# Altium project GEM_HV_channel.PrjPcb (part 2 of 2)
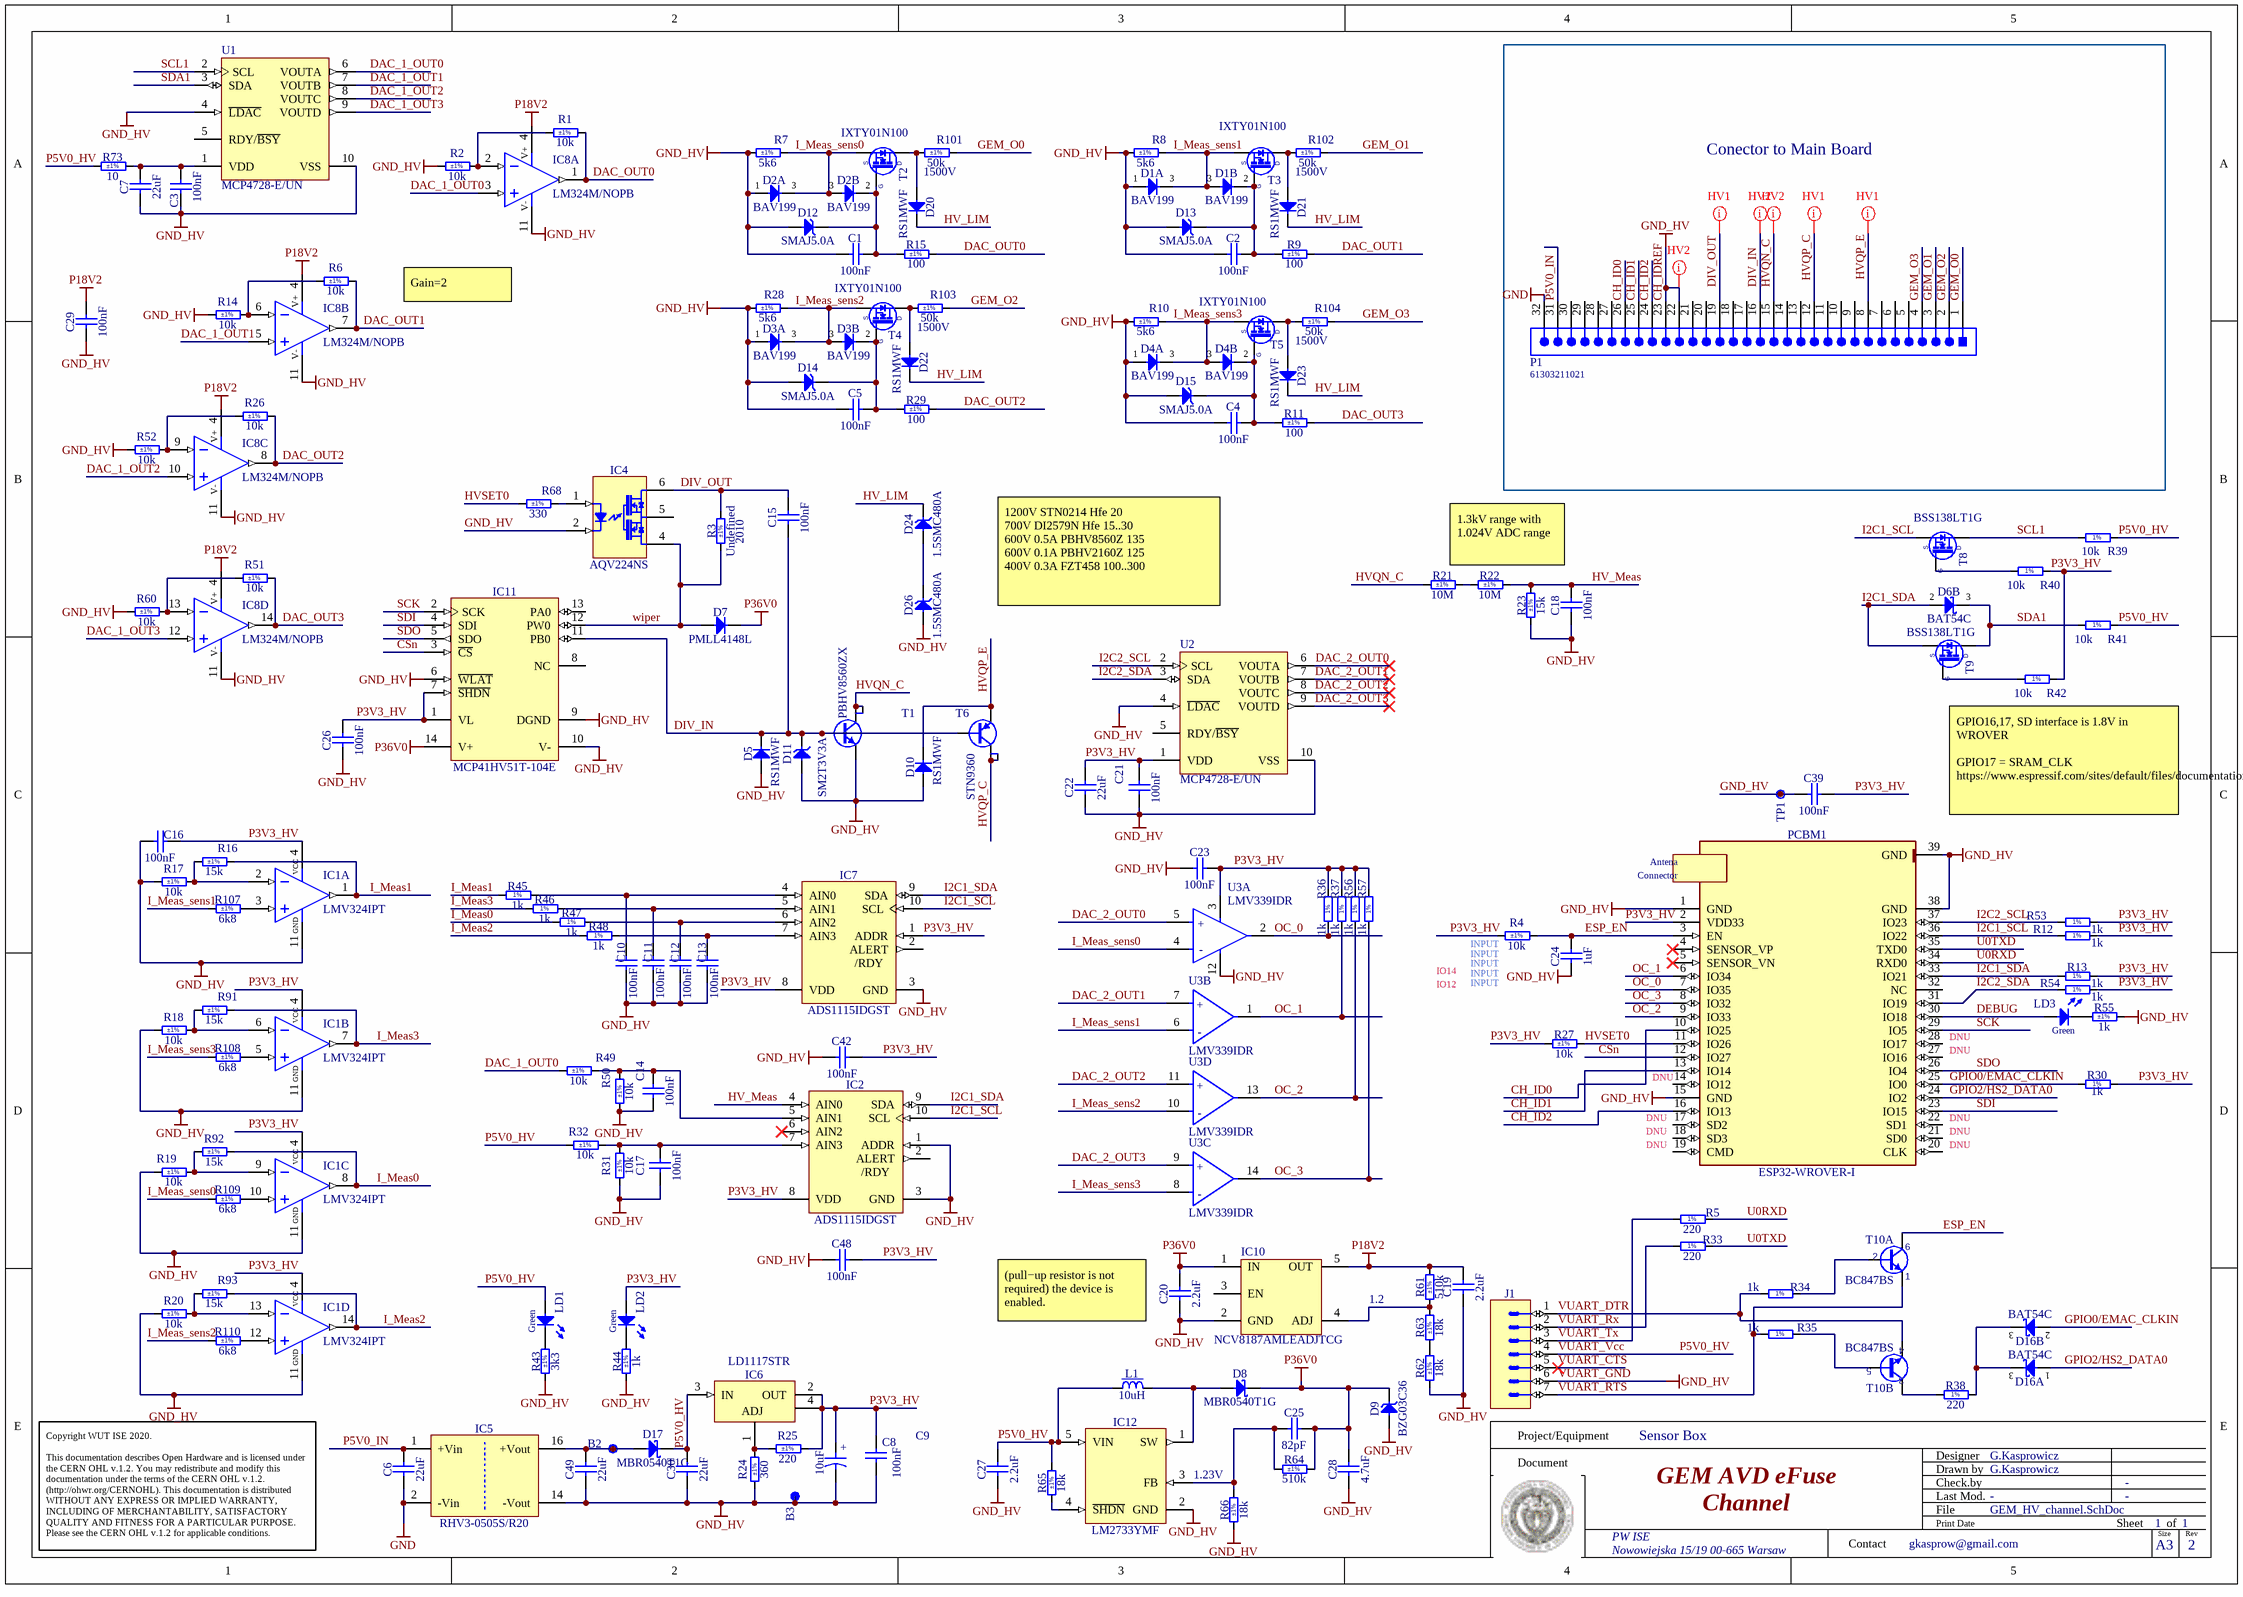
[diagram p1: GEM_HV_channel.SchDoc]

## Sheet GEM_HV_channel.SchDoc: GEM AVD eFuse (continued)

### Library data of the parts
B2 B3 = SMD_PAD_D1MM: Pad; Part Description: 1mm Diameter SMD Pad; Mounted: No; Part Number: SMD_PAD_D1MM; Component Kind: Standard (No BOM); Component Type: Standard (No BOM); Pin Count: 1; Family: SMD Pad; Socket: No; SMD: Yes; Sense: No; Status: None; ComponentHeight: 0mm; HelpURL: Undefined; Author: CERN DEM JLC; CreateDate: 10.10.2017; LatestRevisionDate: 10.10.2017; PackageDescription: 1mm Diameter SMD Pad
C1-C5 C9-C14 C16-C18 C21 C23 C26 C29 C39 C42 C48 = CC0603_100NF_50V_10%_X5R: Non-polarised capacitor; Part Description: SMD Multilayer Chip Ceramic Capacitor; Manufacturer: GENERIC; Manufacturer1 Part Number: C1608X5R1H104K080; Voltage: 50V; TC: X5R; Tolerance: ±10%; Part Number: CC0603_100NF_50V_10%_X5R; Component Kind: Standard; Component Type: Standard; Pin Count: 2; Value: 100nF; Status: None; Manufacturer Part Number: CC0603_100NF_50V_10%_X5R; Case: 0603; Mounted: Yes; Socket: No; SMD: Yes; Sense: No; Manufacturer1 Example: TDK; Manufacturer1 ComponentHeight: 0.9mm; HelpURL: \\cern.ch\dfs\Applications\Altium\Datasheets\CC0603_X5R_TDK_C.pdf; Author: CERN DEM MR; CreateDate: 08.01.2016; LatestRevisionDate: 08.01.2016
C6 C7 C22 C30 C49 = CC0805_22UF_25V_20%_X5R: Non-polarised capacitor; Part Description: Chip Multilayer Ceramic Capacitor for General Purpose; Manufacturer: GENERIC; Manufacturer1 Part Number: GRM21BR61E226ME44; Voltage: 25V; TC: X5R; Tolerance: ±20%; Part Number: CC0805_22UF_25V_20%_X5R; Component Kind: Standard; Component Type: Standard; Pin Count: 2; Value: 22uF; Status: Preferred; Manufacturer Part Number: CC0805_22UF_25V_20%_X5R; Case: 0805; Mounted: Yes; Socket: No; SMD: Yes; Sense: No; ComponentHeight: 1.45mm; Manufacturer1 Example: MURATA; Manufacturer1 ComponentHeight: 1.45mm; HelpURL: \\cern.ch\dfs\Applications\Altium\Datasheets\CC0805_MURATA_GRM21BR61E226ME44.pdf; Author: CERN DEM WB; CreateDate: 08.10.2021; LatestRevisionDate: 08.10.2021
C8 = CAE430-540_10UF_16V_20%: Polarised capacitor; Part Description: Aluminum Electrolytic SMT Capacitor; Manufacturer: PANASONIC; Manufacturer Part Number: EEEFK1C100AR; Voltage: 16V; Tolerance: ±20%; Part Number: CAE430-540_10UF_16V_20%; Component Kind: Standard; Component Type: Standard; Pin Count: 2; Value: 10uF; Status: Not Recommended; Case: B; Mounted: Yes; Socket: No; SMD: Yes; Sense: No; ComponentHeight: 5.8mm; HelpURL: \\cern.ch\dfs\Applications\Altium\Datasheets\CAE_PANASONIC_FK-V.pdf; Author: CERN DEM JLC; CreateDate: 03.12.2007; LatestRevisionDate: 05.11.2014
C15 = CC1812_100NF_1000V_10%_X7R_KEMET_HV FT-CAP: Non-polarised capacitor; Part Description: High Voltage Flexible Termination System (HV FT-CAP) SMD Multilayer Ceramic  Chip Capacitor; Manufacturer: KEMET; Manufacturer Part Number: C1812X104KDRACTU; Voltage: 1000V; TC: X7R; Tolerance: ±10%; Part Number: CC1812_100NF_1000V_10%_X7R_KEMET_HV FT-CAP; Component Kind: Standard; Component Type: Standard; Pin Count: 2; Value: 100nF; Status: None; Case: 1812; Mounted: Yes; Socket: No; SMD: Yes; Sense: No; ComponentHeight: 1.85mm; HelpURL: \\cern.ch\dfs\Applications\Altium\Datasheets\CC1812_X7R_KEMET_HV FT-CAP.pdf; Author: CERN DEM MR; CreateDate: 20.04.2017; LatestRevisionDate: 20.04.2017
C19 C20 C27 = CC0603_2.2UF_16V_10%_X5R: Non-polarised capacitor; Part Description: SMD Multilayer Chip Ceramic Capacitor; Manufacturer: GENERIC; Manufacturer1 Part Number: CC0603KRX5R7BB225; Voltage: 16V; TC: X5R; Tolerance: ±10%; Part Number: CC0603_2.2UF_16V_10%_X5R; Component Kind: Standard; Component Type: Standard; Pin Count: 2; Value: 2.2uF; Status: Preferred; Manufacturer Part Number: CC0603_2.2UF_16V_10%_X5R; Case: 0603; Mounted: Yes; Socket: No; SMD: Yes; Sense: No; Manufacturer1 Example: YAGEO PHYCOMP; Manufacturer1 ComponentHeight: 0.9mm; HelpURL: \\cern.ch\dfs\Applications\Altium\Datasheets\CC0805_X5R_PHYCOMP_HC.pdf; Author: CERN DEM JLC; CreateDate: 28.04.2011; LatestRevisionDate: 28.04.2011
C24 = CC0603_1UF_25V_10%_X7R: Non-polarised capacitor; Part Description: SMD Multilayer Chip Ceramic Capacitor; Manufacturer: GENERIC; Manufacturer1 Part Number: GRM188R71E105KA12D; Voltage: 25V; TC: X7R; Tolerance: ±10%; Part Number: CC0603_1UF_25V_10%_X7R; Component Kind: Standard; Component Type: Standard; Pin Count: 2; Value: 1uF; Status: None; Manufacturer Part Number: CC0603_1UF_25V_10%_X7R; Case: 0603; Mounted: Yes; Socket: No; SMD: Yes; Sense: No; Manufacturer1 Example: MURATA; Manufacturer1 ComponentHeight: 0.9mm; HelpURL: \\cern.ch\dfs\Applications\Altium\Datasheets\CC0603_X7R_MURATA.pdf; Author: CERN DEM JLC; CreateDate: 18/01/2011; LatestRevisionDate: 18/01/2011
C25 = CC0603_82PF_50V_5%_NP0: Non-polarised capacitor; Part Description: SMD Multilayer Chip Ceramic Capacitor; Manufacturer: GENERIC; Manufacturer1 Part Number: 223886715829; Voltage: 50V; TC: C0G/NP0; Tolerance: ±5%; Part Number: CC0603_82PF_50V_5%_NP0; Component Kind: Standard; Component Type: Standard; Pin Count: 2; Value: 82pF; Status: Preferred; Manufacturer Part Number: CC0603_82PF_50V_5%_NP0; Case: 0603; Mounted: Yes; Socket: No; SMD: Yes; Sense: No; Manufacturer1 Example: PHYCOMP; Manufacturer1 ComponentHeight: 0.87mm; HelpURL: \\cern.ch\dfs\Applications\Altium\Datasheets\CC0603_NP0_PHYCOMP.pdf; Author: CERN DEM JLC; CreateDate: 03.12.2007; LatestRevisionDate: 03.12.2007
C28 = CC1210_4.7UF_50V_10%_X7R: Non-polarised capacitor; Part Description: SMD Multilayer Chip Ceramic Capacitor; Manufacturer: GENERIC; Manufacturer1 Part Number: C1210C475K5RAC; Voltage: 50V; TC: X7R; Tolerance: ±10%; Part Number: CC1210_4.7UF_50V_10%_X7R; Component Kind: Standard; Component Type: Standard; Pin Count: 2; Value: 4.7uF; Status: None; Manufacturer Part Number: CC1210_4.7UF_50V_10%_X7R; Case: 1210; Mounted: Yes; Socket: No; SMD: Yes; Sense: No; Manufacturer1 Example: KEMET; Manufacturer1 ComponentHeight: 2.7mm; HelpURL: \\cern.ch\dfs\Applications\Altium\Datasheets\CC1210_X7R_KEMET.pdf; Author: CERN DEM JLC; CreateDate: 01.04.2009; LatestRevisionDate: 05.05.2009
D1-D4 = BAV199: Serial Diode; Part Description: Low-Leakage Double Diode; Manufacturer: NXP SEMICONDUCTORS; Voltage: 75V; Power: 250mW; PressFit: No; Bonding: No; Part Number: BAV199; Component Kind: Standard; Component Type: Standard; Device: BAV199; PackageDescription: SOT, 0.95mm Pitch; 3 Pin, 1.40mm W X 3.00mm L X 1.10mm H body, IPC Medium Density; Manufacturer Part Number: BAV199; Pin Count: 3; Case: SOT23-3; Mounted: Yes; Socket: No; SMD: Yes; Sense: No; ComponentHeight: 1.1mm; HelpURL: \\cern.ch\dfs\Applications\Altium\Datasheets\BAV199.pdf; Author: CERN DEM JMW; CreateDate: 21.11.2008; LatestRevisionDate: 21.11.2008
D5 D10 D20-D23 = RS1MWF: Diode; Part Description: High Voltage Fast Recover Rectifier; Manufacturer: DIODES INCORPORATED; Voltage: 1000V; Power: 1A; PressFit: No; Bonding: No; Part Number: RS1MWF; Component Kind: Standard; Component Type: Standard; Device: RS1MWF; PackageDescription: SODF (SOD-123F) Diode; 1.80mm W X 0.3.50mm L X 1.15mm H body, IPC Medium Density; Manufacturer Part Number: RS1MWF; Pin Count: 2; Case: SOD123F; Mounted: Yes; Socket: No; SMD: Yes; Sense: No; ComponentHeight: 1.15mm; HelpURL: \\cern.ch\dfs\Applications\Altium\Datasheets\RS1MWF.pdf; Author: CERN DEM HF; CreateDate: 29.02.2024; LatestRevisionDate: 29.02.2024
D6 D16 = BAT54C: Dual Common Cathode Schottky Diodes; Part Description: Dual Common Cathode Small Signal Schottky Diode; Manufacturer: FAIRCHILD SEMICONDUCTOR; Voltage: 30V; Power: 200mA; PressFit: No; Bonding: No; Part Number: BAT54C; Component Kind: Standard; Component Type: Standard; Device: BAT54C; PackageDescription: SOT23 3-Leads, Pitch 0.95mm - Body 1.3x2.9mm, IPC Medium Density; Manufacturer Part Number: BAT54C; Pin Count: 3; Case: SOT23-3; Mounted: Yes; Socket: No; SMD: Yes; Sense: No; ComponentHeight: 1.30mm; HelpURL: \\cern.ch\dfs\Applications\Altium\Datasheets\BAT54C.pdf; Author: CERN DEM JLC; CreateDate: 17.09.2009; LatestRevisionDate: 27.05.2010
D7 = PMLL4148L: Diode; Part Description: High-speed switching diodes; Manufacturer: NXP SEMICONDUCTORS; Voltage: 75V; Power: 200mA; PressFit: No; Bonding: No; Part Number: PMLL4148L; Component Kind: Standard; Component Type: Standard; Device: PMLL4148L; PackageDescription: SOD80C, MELF Diode, 2-Leads, Body 3.5x1.5mm, IPC Medium Density; Manufacturer Part Number: PMLL4148L; Pin Count: 2; Case: SOD-80C; Mounted: Yes; Socket: No; SMD: Yes; Sense: No; ComponentHeight: 1.6mm; HelpURL: \\cern.ch\dfs\Applications\Altium\Datasheets\PMLL4148L.pdf; Author: CERN DEM JLC; CreateDate: 30.03.2009; LatestRevisionDate: 09.12.2009
D8 D17 = MBR0540T1G: Schottky Diode; Part Description: Schottky Power Rectifier; Manufacturer: ON SEMICONDUCTOR; Voltage: 40V; Power: 500mA; PressFit: No; Bonding: No; Part Number: MBR0540T1G; Component Kind: Standard; Component Type: Standard; Device: MBR0540T1G; PackageDescription: Diode (SOD-123), 2.70mm W X 1.60mm L X 1.35mm H body, IPC Medium Density; Manufacturer Part Number: MBR0540; Pin Count: 2; Case: SOD-123; Mounted: Yes; Socket: No; SMD: Yes; Sense: No; ComponentHeight: 1.35mm; HelpURL: \\cern.ch\dfs\Applications\Altium\Datasheets\MBR0540T1G.pdf; Author: CERN DEM JLC; CreateDate: 11.04.2011; LatestRevisionDate: 24.05.2022
D9 = BZG03C36: Zener Diode; Part Description: Voltage Regulator Diode; Manufacturer: VISHAY SEMICONDUCTORS; Voltage: 36V; Power: 1.25W; PressFit: No; Bonding: No; Part Number: BZG03C36; Component Kind: Standard; Component Type: Standard; Device: BZG03C36; PackageDescription: DO-214-AC/SMA Molded Diode, Body 5.3x2.6mm, IPC Medium Density; Manufacturer Part Number: BZG03C36; Pin Count: 2; Case: DO-214AC; Mounted: Yes; Socket: No; SMD: Yes; Sense: No; ComponentHeight: 2.3mm; HelpURL: \\cern.ch\dfs\Applications\Altium\Datasheets\BZG03C.pdf; Author: CERN DEM JLC; CreateDate: 02.06.2008; LatestRevisionDate: 02.06.2008
D11 = SM2T3V3A: Transient Voltage Suppressor Diode (Uni-Directional); Part Description: Low voltage Unidirectional Transil™ Diode; Manufacturer: ST MICROELECTRONICS; Voltage: 3V3; Power: 200W; PressFit: No; Bonding: No; Part Number: SM2T3V3A; Component Kind: Standard; Component Type: Standard; Device: SM2T3V3A; PackageDescription: DO-216-AA/SMB Molded Diode, Body 1.9x1.9mm, IPC Medium Density; Manufacturer Part Number: SM2T3V3A; Pin Count: 2; Case: DO-216AA; Mounted: Yes; Socket: No; SMD: Yes; Sense: No; ComponentHeight: 1.15mm; HelpURL: \\cern.ch\dfs\Applications\Altium\Datasheets\SM2T3V3A.pdf; Author: CERN DEM BR; CreateDate: 27.06.2019; LatestRevisionDate: 27.06.2019
D12-D15 = SMAJ5.0A: Transient Voltage Suppressor Diode (Uni-Directional); Part Description: Surface Mount Uni-directional Transient Voltage Suppressor Diode; Manufacturer: BOURNS; Voltage: 5V; Power: 400W; PressFit: No; Bonding: No; Part Number: SMAJ5.0A; Component Kind: Standard; Component Type: Standard; Device: SMAJ5.0A; PackageDescription: DO-214-AC/SMA Diode, Molded Body; 5.21mm L X 2.605mm W X 2.62mm H, IPC Medium Density; Manufacturer Part Number: SMAJ5.0A; Pin Count: 2; Case: DO-214AC; Mounted: Yes; Socket: No; SMD: Yes; Sense: No; ComponentHeight: 2.62mm; HelpURL: \\cern.ch\dfs\Applications\Altium\Datasheets\SMAJ5.0A.pdf; Author: CERN DEM MR; CreateDate: 14.07.2016; LatestRevisionDate: 14.07.2016
D24 D26 = 1.5SMC480A: Transient Voltage Suppressor Diode (Uni-Directional); Part Description: Uni-Directional Transient Voltage Suppressor Diode; Manufacturer: LITTELFUSE; Voltage: 480V; Power: 1500W; PressFit: No; Bonding: No; Part Number: 1.5SMC480A; Component Kind: Standard; Component Type: Standard; Device: 1.5SMC480A; PackageDescription: DO-214-AB/SMC Molded Diode, Body 7.9x5.9mm, IPC Medium Density; Manufacturer Part Number: 1.5SMC480A; Pin Count: 2; Case: DO-214AB; Mounted: Yes; Socket: No; SMD: Yes; Sense: No; ComponentHeight: 2.62mm; HelpURL: \\cern.ch\dfs\Applications\Altium\Datasheets\1.5SMC.pdf; Author: CERN DEM HF; CreateDate: 05.12.2022; LatestRevisionDate: 05.12.2022
IC1 = OA_LMV324_TSSOP: Quad Operational Amplifier; Part Description: Quad Low-Voltage Rail-To-Rail Output Operational Amplifier; Manufacturer: TEXAS INSTRUMENTS; PressFit: No; Bonding: No; Table: Operational Amplifiers; Part Number: LMV324IPT; Component Kind: Standard; Component Type: Standard; Device: LMV324IPT; PackageDescription: TSSOP 14, Pitch 0.65 mm - Body 5x86.4mm, IPC Medium Density; Manufacturer Part Number: LMV324IPT; Pin Count: 14; Case: TSSOP14; Mounted: Yes; Socket: No; SMD: Yes; ComponentHeight: 1.80mm; Author: GK; HelpURL: \\cern.ch\dfs\Applications\Altium\Datasheets\LMV324ID.pdf; CreateDate: 2011-08-24; LatestRevisionDate: 2011-08-24
IC2 IC7 = ADS1115IDGST: Ultra-Small, Low-Power, 16-Bit Analog-to-Digital Converter with Internal Reference; Part Description: Ultra-Small, Low-Power, 4 Channels 16-Bit Analog-to-Digital Converter with Internal Reference; Manufacturer: TEXAS INSTRUMENTS; PressFit: No; Bonding: No; Part Number: ADS1115IDGST; Component Kind: Standard; Component Type: Standard; Device: ADS1115IDGST; PackageDescription: SOP, 0.50mm Pitch; 10 Pin, 3.00mm W X 3.00mm L X 1.10mm H body, IPC Medium Density; Manufacturer Part Number: ADS1115IDGS; Pin Count: 10; Case: MSOP10; Mounted: Yes; Socket: No; SMD: Yes; Sense: No; ComponentHeight: 1.1mm; Author: CERN DEM JLC; HelpURL: \\cern.ch\dfs\Applications\Altium\Datasheets\ADS1115IDGST.pdf; CreateDate: 29.10.2012; LatestRevisionDate: 13.06.2022
IC4 = OPTOMOS_AQV224NS: PhotoMOS Relay 400V 40mA; Part Description: GU SOP 1 Form A, PhotoMOS Relay, 400V 40mA; Manufacturer: PANASONIC; PressFit: No; Bonding: No; Part Number: AQV224NS; Component Kind: Standard; Component Type: Standard; Device: AQV224NS; Footprint: PANASONIC_AQV224NS; PackageDescription: PANASONIC Serie AQV21(SOP), 2.54mm Pitch; 6 Pin, 4.40mm W X 6.30mm L X 2.30mm H body; Manufacturer Part Number: AQV224NS; Pin Count: 6; Case: SOP6; Mounted: Yes; Socket: No; SMD: Yes; Sense: No; ComponentHeight: 2.3mm; HelpURL: \\cern.ch\dfs\Applications\Altium\Datasheets\AQV212S.pdf; ComponentLink1Description: Package Drawing; ComponentLink1URL: \\cern.ch\dfs\Applications\Altium\Datasheets\AQV21_Package-Drawing.pdf; Author: GK; CreateDate: 03.09.2010; LatestRevisionDate: 04.12.2018
IC5 = RHV3-0505S/R20: RECOM, RP Series, Single Output DCDC Converter; Part Description: 5VDC to +5VDC (600mA), 3W  Unregulated DC-DC Converter; PressFit: No; Bonding: No; Part Number: RHV3-0505S/R20; Component Kind: Standard; Component Type: Standard; Device: RHV3-0505S/R20; PackageDescription: RHV3 Series, Body 45x15mm, SIP16 Package; Manufacturer: RECOM; Manufacturer Part Number: RHV3-0505S/R20; Pin Count: 4; Mounted: Yes; Socket: No; SMD: No; Sense: No; ComponentHeight: 10.50mm; HelpURL: \\cern.ch\dfs\Applications\Altium\Datasheets\RHV3.pdf; Author: CERN DEM HF; CreateDate: 23.05.2023; LatestRevisionDate: 23.05.2023
IC6 = LD1117STR: 3-Terminal Regulator 1=Adj 2=OUT 3=IN 4=OUT; Part Description: 1.25V To 15V Adjustable, 800mA Low-Dropout Positive Voltage Regulator; Manufacturer: ST MICROELECTRONICS; PressFit: No; Bonding: No; Part Number: LD1117STR; Component Kind: Standard; Component Type: Standard; Device: LD1117STR; PackageDescription: SOT223, 2.30mm Pitch; 4 Pin, 3.70mm W X 6.70mm L X 1.80mm H body, IPC Medium Density; Manufacturer Part Number: LD1117STR; Pin Count: 4; Case: SOT223; Mounted: Yes; Socket: No; SMD: Yes; Sense: No; ComponentHeight: 1.8mm; HelpURL: \\cern.ch\dfs\Applications\Altium\Datasheets\LD1117STR.pdf; Author: CERN DEM MR; CreateDate: 14.07.2016; LatestRevisionDate: 14.07.2016
IC8 = LM324M/NOPB: Quad Operational Amplifier; Manufacturer: FAIRCHILD SEMICONDUCTOR; Manufacturer Part Number: LM324M; PressFit: No; Bonding: No; Part Number: LM324M/NOPB; Component Kind: Standard; Component Type: Standard; Device: LM324M/NOPB; PackageDescription: SOIC 14, Pitch 1.27mm - Body 4x8.75mm, IPC Medium Density; Part Description: Quad Operational Amplifier; Pin Count: 14; Case: SOIC14; Mounted: Yes; Socket: No; SMD: Yes; Sense: No; ComponentHeight: 1.80mm; Author: CERN DEM JLC; HelpURL: \\cern.ch\dfs\Applications\Altium\Datasheets\LM324M-NOPB.pdf; CreateDate: 13.04.2010; LatestRevisionDate: 02.06.2022
IC10 = NCV8730ASNADJT1G: LDO Regulator, 150 mA, / 38V; Manufacturer: Onsemi; Manufacturer Part number: NCV8730ASNADJT1G; Footprint: TSSOP5
IC11 = MCP41HV51T-104E: 8-Bit Single, +36V (±18V) Digital POT with SPI /100kOhm (-40°C to 125°C); Manufacturer: MICROCHIP TECHNOLOGY; PressFit: No; Bonding: No; Part Number: MCP41HV51T-104E; Component Kind: Standard; Component Type: Standard; Device: MCP41HV51T-104E; PackageDescription: SOP, 14-Leads, Body 5.1x4.5mm (max), Pitch 0.65mm, IPC Medium Density; Part Description: 8-Bit Single, +36V (±18V) Digital POT with SPI /100kOhm (-40°C to 125°C); Manufacturer Part Number: MCP41HV51T-104E; Pin Count: 14; Case: TSSOP14; Mounted: Yes; Socket: No; SMD: Yes; Sense: No; ComponentHeight: 1.2mm; HelpURL: \\cern.ch\dfs\Applications\Altium\Datasheets\MCP45HVX1.pdf; Author: GK; CreateDate: 28.02.2024; LatestRevisionDate: 28.02.2024
IC12 = PM_LM2733YMF: 0.6/1.6 MHz Boost Converters With 40V Internal FET Switch in SOT-23; Part Description: 0.6 MHz Boost Converters with 40V Internal FET Switch in SOT-23; Manufacturer: TEXAS INSTRUMENTS; PressFit: No; Bonding: No; Part Number: LM2733YMF; Component Kind: Standard; Component Type: Standard; Device: LM2733YMF; PackageDescription: SOT23, 0.95mm Pitch; 5 Pin, 1.67mm W X 2.99mm L X 1.22mm H body, IPC Medium Density; Manufacturer Part Number: LM2733YMF; Pin Count: 5; Case: SOT23-5; Mounted: Yes; Socket: No; SMD: Yes; Sense: No; ComponentHeight: 1.22mm; HelpURL: \\cern.ch\dfs\Applications\Altium\Datasheets\LM2733XMF.pdf; Author: GK; CreateDate: 06.04.2009; LatestRevisionDate: 16.09.2014
J1 = SAMTEC_TSW-107-07-L-S-LL: Connector 7 Male; Part Description: 7 Contacts, Pitch 2.54mm, Single Row  Through Mount Straigh Header (Post Lead 5.84mm, Tail Lead 2.54mm, Insulator 2.54mm); Manufacturer: SAMTEC; PressFit: No; Part Number: SAMTEC_TSW-107-07-L-S-LL; Component Kind: Standard; Component Type: Standard; Pin Count: 7; Family: Header 7; Mounted: Yes; Socket: No; SMD: No; Sense: No; Status: None; Manufacturer Part Number: TSW-107-07-L-S-LL; ComponentHeight: 8.38mm; HelpURL: \\cern.ch\dfs\Applications\Altium\Datasheets\SAMTEC_TSW-107-07-L-S-LL.pdf; Author: CERN DEM MR; CreateDate: 07.12.2016; LatestRevisionDate: 07.12.2016
L1 = IND_10UH_20%_TDK_VLCF5020-1: Inductor With Core; Part Description: SMD Inductor for Power Circuits (Wound/STD , Magnetic Shielded), VLCF series; Manufacturer: TDK; Manufacturer Part Number: VLCF5020T-100M1R1-1; Power: 1.5A; Resistance: 0.198R; Tolerance: ±20%; Part Number: IND_10UH_20%_TDK_VLCF5020-1; Component Kind: Standard; Component Type: Standard; Pin Count: 2; Value: 10uH; Mounted: Yes; Socket: No; SMD: Yes; Sense: No; ComponentHeight: 2mm; HelpURL: \\cern.ch\dfs\Applications\Altium\Datasheets\IND_TDK_VLCF.pdf; Author: CERN DEM JLC; CreateDate: 10.07.2014; LatestRevisionDate: 10.07.2014
LD1-LD3 = LED_KINGBRIGHT_KP-1608CGCK: LED Green 1C 2A; Part Description: 1.6x0.8mm SMD Chip Green LED Lamp; PressFit: No; Bonding: No; Part Number: LED_KINGBRIGHT_KP-1608CGCK; Component Kind: Standard; Component Type: Standard; Color: Green; PackageDescription: SMT Green LED, Case 0603, Body L 1.60mm x W 0.80mm x H 1.10mm; Manufacturer: KINGBRIGHT; Manufacturer Part Number: KP-1608CGCK; Pin Count: 2; Case: 0603; Mounted: Yes; Socket: No; SMD: Yes; Sense: No; ComponentHeight: 1.1mm; HelpURL: \\cern.ch\dfs\Applications\Altium\Datasheets\LED_KINGBRIGHT_KP-1608CGCK.pdf; Author: CERN DEM HF; CreateDate: 01.10.2021; LatestRevisionDate: 01.10.2021
P1 = 61303211021: WR-PHD Pin Header, THT, pitch 2.54mm, Single Row, Angled, 32p; Manufacturer: Wurth Elektronik; Pin Number: 32; Rated Current: 3A; Working Voltage: 250VAC; Withstanding Voltage: 500VAC; Contact Resistance: 20mOhm; ComponentLink1Description: Manufacturer; ComponentLink1URL: http://www.we-online.de; ComponentLink2Description: Datasheet; ComponentLink2URL: https://www.we-online.com/catalog/datasheet/61303211021.pdf; Manufacturer Part Number: 61303211021; Pitch: 2.54mm; Operating Temperature: -40 to +105degC; Mounting Technology: THT; Packaging: Bag; Gender: Pin Header; Row Number: Single; Orientation: Angled
PCBM1 = PCBM_ESP32-WROVER-I: Generic WiFi-BT-BLE MCU Module; Part Description: Generic WiFi-BT-BLE MCU Module (IPEX antenna, 32-Mbit PSRAM); Manufacturer: ESPRESSIF; PressFit: No; Bonding: No; Part Number: PCBM_ESP32-WROVER-I; Component Kind: Standard; Component Type: Standard; Device: ESP32-WROVER-I; PackageDescription: Generic WiFi-BT-BLE MCU Module (IPEX antenna) ,Body 18.00mm x 31.4mm; Manufacturer Part Number: ESP32-WROVER-I; Pin Count: 39; Mounted: Yes; Socket: No; SMD: Yes; Sense: No; ComponentHeight: 3.65mm; Author: CERN DEM JLC; HelpURL: \\cern.ch\dfs\Applications\Altium\Datasheets\PCBM_ESP32-WROVER-I.pdf; CreateDate: 14.11.2017; LatestRevisionDate: 14.11.2017
R1 R2 R4 R6 R14 R17-R20 R26 R27 R31 R32 R49-R52 R60 = R0603_10K_1%_0.1W_100PPM: Resistor - 1%; Part Description: General Purpose Thick Film Chip Resistor; Manufacturer: GENERIC; Manufacturer1 Part Number: NRC06F1002TRF; Power: 0.1W; TC: ±100ppm/°C; PressFit: No; Part Number: R0603_10K_1%_0.1W_100PPM; Component Kind: Standard; Component Type: Standard; Pin Count: 2; Value: 10k; Status: Preferred; Manufacturer Part Number: R0603_10K_1%_0.1W_100PPM; Case: 0603; Mounted: Yes; Sense: No; Socket: No; SMD: Yes; Manufacturer1 Example: NIC COMPONENT; Manufacturer1 ComponentHeight: 0.55mm; HelpURL: \\cern.ch\dfs\Applications\Altium\Datasheets\R0603_NIC_NRC.pdf; Author: CERN DEM JLC; CreateDate: 03.12.2007; LatestRevisionDate: 13.03.2008
R3 = R2010_1G_1%_0.5W_100PPM_VISHAY_CRHV2010AF1G00FKET: Resistor - 1%; Manufacturer: VISHAY TECHNO; Power: 0.5W; TC: ±100ppm/°C; PressFit: No; Part Number: Undefined; Component Kind: Standard; Component Type: Standard; Pin Count: 2; Value: Undefined; Status: None; Part Description: Undefined; Manufacturer Part Number: Undefined; Mounted: Yes; Sense: No; Socket: No; SMD: Yes; ComponentHeight: 0.68mm; HelpURL: \\cern.ch\dfs\Applications\Altium\Datasheets\R2010_VISHAY_CRHV.pdf; Author: CERN DEM JLC; CreateDate: 03.06.2015; LatestRevisionDate: 03.06.2015
R5 R33 R38 = R0402_220R_1%_0.0625W_100PPM: Resistor - 1%; Part Description: General Purpose Thick Film Chip Resistor; Manufacturer: GENERIC; Manufacturer1 Part Number: 232270672201L; TC: ±100ppm/°C; PressFit: No; Part Number: R0402_220R_1%_0.0625W_100PPM; Component Kind: Standard; Component Type: Standard; Pin Count: 2; Value: 220; Status: Not Recommended; Power: 0.0625W; Tolerance: ±1%; Manufacturer Part Number: R0402_220R_1%_0.0625W_100PPM; Case: 0402; Mounted: Yes; Sense: No; Socket: No; SMD: Yes; Manufacturer1 Example: YAGEO PHYCOMP; Manufacturer1 ComponentHeight: 0.4mm; HelpURL: \\cern.ch\dfs\Applications\Altium\Datasheets\R0402_Phycomp_RC0402.pdf; Author: CERN DEM JLC; CreateDate: 03.12.2007; LatestRevisionDate: 17.10.2012
R7 R8 R10 R28 = R0805_5K6_1%_0.125W_100PPM: Resistor - 1%; Part Description: General Purpose Thick Film Chip Resistor; Manufacturer: GENERIC; Manufacturer1 Part Number: NRC10F5601TRF; Power: 0.125W; TC: ±100ppm/°C; PressFit: No; Part Number: R0805_5K6_1%_0.125W_100PPM; Component Kind: Standard; Component Type: Standard; Pin Count: 2; Value: 5k6; Status: Preferred; Manufacturer Part Number: R0805_5K6_1%_0.125W_100PPM; Case: 0805; Mounted: Yes; Sense: No; Socket: No; SMD: Yes; Manufacturer1 Example: NIC COMPONENT; Manufacturer1 ComponentHeight: 0.6mm; HelpURL: \\cern.ch\dfs\Applications\Altium\Datasheets\R0805_NIC_NRC.pdf; Author: CERN DEM JLC; CreateDate: 03.12.2007; LatestRevisionDate: 13.03.2008
R9 R11 R15 R29 = R0603_100R_1%_0.1W_100PPM: Resistor - 1%; Part Description: General Purpose Thick Film Chip Resistor; Manufacturer: GENERIC; Manufacturer1 Part Number: NRC06F4700TRF; Power: 0.1W; TC: ±100ppm/°C; PressFit: No; Part Number: R0603_100R_1%_0.1W_100PPM; Component Kind: Standard; Component Type: Standard; Pin Count: 2; Value: 100; Status: Preferred; Manufacturer Part Number: R0603_100R_1%_0.1W_100PPM; Case: 0603; Mounted: Yes; Sense: No; Socket: No; SMD: Yes; Manufacturer1 Example: NIC COMPONENT; Manufacturer1 ComponentHeight: 0.55mm; HelpURL: \\cern.ch\dfs\Applications\Altium\Datasheets\R0603_NIC_NRC.pdf; Author: CERN DEM JLC; CreateDate: 03.12.2007; LatestRevisionDate: 13.03.2008
R12 R13 R30 R34-R37 R44-R48 R53-R57 = R0402_1K_1%_0.0625W_100PPM: Resistor - 1%; Part Description: General Purpose Thick Film Chip Resistor; Manufacturer: GENERIC; Manufacturer1 Part Number: 232270671002L; TC: ±100ppm/°C; PressFit: No; Part Number: R0402_1K_1%_0.0625W_100PPM; Component Kind: Standard; Component Type: Standard; Pin Count: 2; Value: 1k; Status: Not Recommended; Power: 0.0625W; Manufacturer Part Number: R0402_1K_1%_0.0625W_100PPM; Case: 0402; Mounted: Yes; Sense: No; Socket: No; SMD: Yes; Manufacturer1 Example: YAGEO PHYCOMP; Manufacturer1 ComponentHeight: 0.4mm; HelpURL: \\cern.ch\dfs\Applications\Altium\Datasheets\R0402_Phycomp_RC0402.pdf; Author: CERN DEM JLC; CreateDate: 03.12.2007; LatestRevisionDate: 17.10.2012
  R12 R13 R30 R34-R37 R45-R48 R53 R54 R56 R57: Tolerance: ±1%
R16 R23 R91-R93 = R0603_15K_1%_0.1W_100PPM: Resistor - 1%; Part Description: General Purpose Thick Film Chip Resistor; Manufacturer: GENERIC; Manufacturer1 Part Number: NRC06F1502TRF; Power: 0.1W; TC: ±100ppm/°C; PressFit: No; Part Number: R0603_15K_1%_0.1W_100PPM; Component Kind: Standard; Component Type: Standard; Pin Count: 2; Value: 15k; Status: Preferred; Manufacturer Part Number: R0603_15K_1%_0.1W_100PPM; Case: 0603; Mounted: Yes; Sense: No; Socket: No; SMD: Yes; Manufacturer1 Example: NIC COMPONENT; Manufacturer1 ComponentHeight: 0.55mm; HelpURL: \\cern.ch\dfs\Applications\Altium\Datasheets\R0603_NIC_NRC.pdf; Author: CERN DEM JMW; CreateDate: 17.08.2015; LatestRevisionDate: 17.08.2015
R21 R22 = R2010_10M_1%_0.5W_200PPM: Resistor - 1%; Part Description: Thick Film Chip Resistor; Manufacturer: GENERIC; Manufacturer1 Part Number: LHVC2010-10MFT4; Power: 0.5W; TC: ±200ppm/°C; PressFit: No; Part Number: R2010_10M_1%_0.5W_200PPM; Component Kind: Standard; Component Type: Standard; Pin Count: 2; Value: 10M; Status: None; Manufacturer Part Number: R2010_10M_1%_0.5W_200PPM; Case: 2010; Mounted: Yes; Sense: No; Socket: No; SMD: Yes; Manufacturer1 Example: TT WELWYN; Manufacturer1 ComponentHeight: 0.65mm; HelpURL: \\cern.ch\dfs\Applications\Altium\Datasheets\R2010_WELWYN_LHVC.pdf; Author: CERN DEM JLC; CreateDate: 26.02.2015; LatestRevisionDate: 26.02.2015
R24 = R0603_360R_1%_0.1W_100PPM: Resistor - 1%; Part Description: General Purpose Thick Film Chip Resistor; Manufacturer: GENERIC; Manufacturer1 Part Number: NRC06F3600TRF; Power: 0.1W; TC: ±100ppm/°C; PressFit: No; Part Number: R0603_360R_1%_0.1W_100PPM; Component Kind: Standard; Component Type: Standard; Pin Count: 2; Value: 360; Status: Preferred; Manufacturer Part Number: R0603_360R_1%_0.1W_100PPM; Case: 0603; Mounted: Yes; Sense: No; Socket: No; SMD: Yes; Manufacturer1 Example: NIC COMPONENT; Manufacturer1 ComponentHeight: 0.55mm; HelpURL: \\cern.ch\dfs\Applications\Altium\Datasheets\R0603_NIC_NRC.pdf; Author: CERN DEM JLC; CreateDate: 03.12.2007; LatestRevisionDate: 13.03.2008
R25 = R0603_220R_1%_0.1W_100PPM: Resistor - 1%; Part Description: General Purpose Thick Film Chip Resistor; Manufacturer: GENERIC; Manufacturer1 Part Number: NRC06F2200TRF; Power: 0.1W; TC: ±100ppm/°C; PressFit: No; Part Number: R0603_220R_1%_0.1W_100PPM; Component Kind: Standard; Component Type: Standard; Pin Count: 2; Value: 220; Status: Preferred; Manufacturer Part Number: R0603_220R_1%_0.1W_100PPM; Case: 0603; Mounted: Yes; Sense: No; Socket: No; SMD: Yes; Manufacturer1 Example: NIC COMPONENT; Manufacturer1 ComponentHeight: 0.55mm; HelpURL: \\cern.ch\dfs\Applications\Altium\Datasheets\R0603_NIC_NRC.pdf; Author: CERN DEM JLC; CreateDate: 03.12.2007; LatestRevisionDate: 13.03.2008
R39-R42 = R0402_10K_1%_0.0625W_100PPM: Resistor - 1%; Part Description: General Purpose Thick Film Chip Resistor; Manufacturer: GENERIC; Manufacturer1 Part Number: 232270671003L; TC: ±100ppm/°C; Table: Resistors SMD; Part Number: R0402_10K_1%_0.0625W_100PPM; Component Kind: Standard; Component Type: Standard; Pin Count: 2; Value: 10k; Status: Not recommended; Power: 0.0625W; Tolerance: ±1%; Manufacturer Part Number: R0402_10K_1%_0.0625W_100PPM; Case: 0402; Mounted: Yes; Socket: No; SMD: Yes; Manufacturer1 Example: YAGEO PHYCOMP; Manufacturer1 ComponentHeight: 0.4mm; HelpURL: \\cern.ch\dfs\Applications\Altium\Datasheets\R0402_Phycomp_RC0402.pdf; Author: CERN DEM JLC; CreateDate: 2007-12-03; LatestRevisionDate: 2012-10-17
R43 = R0402_3K3_1%_0.0625W_100PPM: Resistor - 1%; Part Description: General Purpose Thick Film Chip Resistor; Manufacturer: GENERIC; Manufacturer1 Part Number: 232270673302L; TC: ±100ppm/°C; PressFit: No; Part Number: R0402_3K3_1%_0.0625W_100PPM; Component Kind: Standard; Component Type: Standard; Pin Count: 2; Value: 3k3; Status: Not Recommended; Power: 0.0625W; Manufacturer Part Number: R0402_3K3_1%_0.0625W_100PPM; Case: 0402; Mounted: Yes; Sense: No; Socket: No; SMD: Yes; Manufacturer1 Example: YAGEO PHYCOMP; Manufacturer1 ComponentHeight: 0.4mm; HelpURL: \\cern.ch\dfs\Applications\Altium\Datasheets\R0402_Phycomp_RC0402.pdf; Author: CERN DEM JLC; CreateDate: 03.12.2007; LatestRevisionDate: 17.10.2012
R61 R64 = R0603_510K_1%_0.1W_100PPM: Resistor - 1%; Part Description: General Purpose Thick Film Chip Resistor; Manufacturer: GENERIC; Manufacturer1 Part Number: NRC06F5103TRF; Power: 0.1W; TC: ±100ppm/°C; PressFit: No; Part Number: R0603_510K_1%_0.1W_100PPM; Component Kind: Standard; Component Type: Standard; Pin Count: 2; Value: 510k; Status: Preferred; Manufacturer Part Number: R0603_510K_1%_0.1W_100PPM; Case: 0603; Mounted: Yes; Sense: No; Socket: No; SMD: Yes; Manufacturer1 Example: NIC COMPONENT; Manufacturer1 ComponentHeight: 0.55mm; HelpURL: \\cern.ch\dfs\Applications\Altium\Datasheets\R0603_NIC_NRC.pdf; Author: CERN DEM JLC; CreateDate: 03.12.2007; LatestRevisionDate: 13.03.2008
R62 R63 R65 R66 = R0603_18K_1%_0.1W_100PPM: Resistor - 1%; Part Description: General Purpose Thick Film Chip Resistor; Manufacturer: GENERIC; Manufacturer1 Part Number: NRC06F1802TRF; Power: 0.1W; TC: ±100ppm/°C; PressFit: No; Part Number: R0603_18K_1%_0.1W_100PPM; Component Kind: Standard; Component Type: Standard; Pin Count: 2; Value: 18k; Status: Preferred; Manufacturer Part Number: R0603_18K_1%_0.1W_100PPM; Case: 0603; Mounted: Yes; Sense: No; Socket: No; SMD: Yes; Manufacturer1 Example: NIC COMPONENT; Manufacturer1 ComponentHeight: 0.55mm; HelpURL: \\cern.ch\dfs\Applications\Altium\Datasheets\R0603_NIC_NRC.pdf; Author: CERN DEM JLC; CreateDate: 03.12.2007; LatestRevisionDate: 13.03.2008
R68 = R0402_330R_1%_0.0625W_100PPM: Resistor - 1%; Part Description: General Purpose Thick Film Chip Resistor; Manufacturer: GENERIC; Manufacturer1 Part Number: 232270673301L; TC: ±100ppm/°C; PressFit: No; Part Number: R0402_330R_1%_0.0625W_100PPM; Component Kind: Standard; Component Type: Standard; Pin Count: 2; Value: 330; Status: Not Recommended; Power: 0.0625W; Manufacturer Part Number: R0402_330R_1%_0.0625W_100PPM; Case: 0402; Mounted: Yes; Sense: No; Socket: No; SMD: Yes; Manufacturer1 Example: YAGEO PHYCOMP; Manufacturer1 ComponentHeight: 0.4mm; HelpURL: \\cern.ch\dfs\Applications\Altium\Datasheets\R0402_Phycomp_RC0402.pdf; Author: CERN DEM JLC; CreateDate: 03.12.2007; LatestRevisionDate: 17.10.2012
R73 = R0402_10R_1%_0.0625W_200PPM: Resistor - 1%; Part Description: General Purpose Thick Film Chip Resistor; Manufacturer: GENERIC; Manufacturer1 Part Number: 232270671009L; TC: ±200ppm/°C; PressFit: No; Part Number: R0402_10R_1%_0.0625W_200PPM; Component Kind: Standard; Component Type: Standard; Pin Count: 2; Value: 10; Status: Not Recommended; Power: 0.0625W; Manufacturer Part Number: R0402_10R_1%_0.0625W_200PPM; Case: 0402; Mounted: Yes; Sense: No; Socket: No; SMD: Yes; Manufacturer1 Example: YAGEO PHYCOMP; Manufacturer1 ComponentHeight: 0.4mm; HelpURL: \\cern.ch\dfs\Applications\Altium\Datasheets\R0402_Phycomp_RC0402.pdf; Author: CERN DEM JLC; CreateDate: 24.06.2009; LatestRevisionDate: 17.10.2012
R101-R104 = R1206_50K_1%_0.33W_100PPM_SEI_HVC: Resistor - 1%; Part Description: High Voltage Thick Film Chip Resistor; Manufacturer: SEI (STACKPOLE ELECTRONICS INC.); Manufacturer Part Number: HVCB1206FDD50K0; Power: 0.33W; TC: ±100ppm/°C; PressFit: No; Part Number: R1206_50K_1%_0.33W_100PPM_SEI_HVC; Component Kind: Standard; Component Type: Standard; Pin Count: 2; Value: 50k; Status: None; Case: 1206; Mounted: Yes; Sense: No; Socket: No; SMD: Yes; ComponentHeight: 0.76mm; HelpURL: \\cern.ch\dfs\Applications\Altium\Datasheets\R1206_SEI_HVC.pdf; Author: CERN DEM JLC; CreateDate: 18.01.2018; LatestRevisionDate: 28.06.2022
R107-R110 = R0603_6K8_1%_0.1W_100PPM: Resistor - 1%; Part Description: General Purpose Thick Film Chip Resistor; Manufacturer: GENERIC; Manufacturer1 Part Number: NRC06F6801TRF; Power: 0.1W; TC: ±100ppm/°C; PressFit: No; Part Number: R0603_6K8_1%_0.1W_100PPM; Component Kind: Standard; Component Type: Standard; Pin Count: 2; Value: 6k8; Status: Preferred; Manufacturer Part Number: R0603_6K8_1%_0.1W_100PPM; Case: 0603; Mounted: Yes; Sense: No; Socket: No; SMD: Yes; Manufacturer1 Example: NIC COMPONENT; Manufacturer1 ComponentHeight: 0.55mm; HelpURL: \\cern.ch\dfs\Applications\Altium\Datasheets\R0603_NIC_NRC.pdf; Author: CERN DEM JLC; CreateDate: 03.12.2007; LatestRevisionDate: 13.03.2008
T1 = Q_PBHV8560Z: 600 V, 0.5 A NPN high-voltage low VCEsat (BISS) transistor; Part Description: 600V 500mA NPN High Voltage Transistor; Manufacturer: Nexperia; PressFit: No; Bonding: No; Part Number: PBHV8560ZX; Component Kind: Standard; Component Type: Standard; Device: PBHV8560ZX; PackageDescription: SOT223, 2.30mm Pitch; 4 Pin, 3.70mm W X 6.70mm L X 1.80mm H body, IPC Medium Density; Manufacturer Part Number: PBHV8560ZX; Pin Count: 4; Case: SOT223; Mounted: Yes; Socket: No; SMD: Yes; Sense: No; ComponentHeight: 1.8mm; HelpURL: \\cern.ch\dfs\Applications\Altium\Datasheets\FZT458TA.pdf; Author: GK; CreateDate: 15.06.2011; LatestRevisionDate: 15.06.2011
T2-T5 = IXTY01N100: N-CHANNEL MOSFET WITH DIODE; Part Description: 1000V 100mA N-Channel High Voltage MOSFET; Manufacturer: IXYS; PressFit: No; Bonding: No; Part Number: IXTY01N100; Component Kind: Standard; Component Type: Standard; Device: IXTY01N100; PackageDescription: TO-252AA DPAK TO, 2.28mm pitch; 2 pin,9.91mm L X 6.095mm W X 2.38mm H body, IPC Medium Density; Manufacturer Part Number: IXTY01N100; Pin Count: 3; Case: DPAK; Mounted: Yes; Socket: No; SMD: Yes; Sense: No; ComponentHeight: 2.38mm; HelpURL: \\cern.ch\dfs\Applications\Altium\Datasheets\IXTY01N100.pdf; Author: CERN DEM JLC; CreateDate: 04.02.2009; LatestRevisionDate: 31.01.2011
T6 = STN9360: PNP Transistor; Part Description: 250V 100mA PNP High-Voltage Transistors; Manufacturer: STMicroelectronics; PressFit: No; Bonding: No; Part Number: STN9360; Component Kind: Standard; Component Type: Standard; Device: STN9360; PackageDescription: SOT223, 2.30mm Pitch; 4 Pin, 3.70mm W X 6.70mm L X 1.80mm H body, IPC Medium Density; Manufacturer Part Number: STN9360; Pin Count: 4; Case: SOT223; Mounted: Yes; Socket: No; SMD: Yes; Sense: No; ComponentHeight: 1.8mm; HelpURL: \\cern.ch\dfs\Applications\Altium\Datasheets\BF723,115.pdf; Author: FS; CreateDate: 15.06.2011; LatestRevisionDate: 15.06.2011
T8 T9 = BSS138LT1G: N-CHANNEL MOSFET WITH DIODE; Part Description: 50V, 200mA N-Channel Enhancement Mode Field-Effect Transistor; Manufacturer: ON SEMICONDUCTOR; PressFit: No; Bonding: No; Part Number: BSS138LT1G; Component Kind: Standard; Component Type: Standard; Device: BSS138LT1G; PackageDescription: SOT23, 0.95mm Pitch; 3 Pin, 1.40mm W X 3.00mm L X 1.10mm H body, IPC Medium Density; Manufacturer Part Number: BSS138L; Pin Count: 3; Case: SOT23-3; Mounted: Yes; Socket: No; SMD: Yes; Sense: No; ComponentHeight: 1.11mm; HelpURL: \\cern.ch\dfs\Applications\Altium\Datasheets\BSS138LT1G.pdf; Author: CERN DEM JLC; CreateDate: 23.03.2009; LatestRevisionDate: 25.05.2022
T10 = BC847BS: 45V 100mA Dual NPN General-Purpose Transistor; Manufacturer: NXP SEMICONDUCTORS; PressFit: No; Bonding: No; Part Number: BC847BS; Component Kind: Standard; Component Type: Standard; Device: BC847BS; PackageDescription: SOT363, SC-88, SOT, 0.65mm Pitch, 6 pin, 1.25mm W X 2.00mm L X 1.10mm H, IPC Medium Density; Part Description: 45V 100mA Dual NPN General-Purpose Transistor; Manufacturer Part Number: BC847BS; Pin Count: 6; Case: SOT363; Mounted: Yes; Socket: No; SMD: Yes; Sense: No; ComponentHeight: 1.1mm; HelpURL: \\cern.ch\dfs\Applications\Altium\Datasheets\BC847BS.pdf; Author: CERN DEM JMW; CreateDate: 10.07.2015; LatestRevisionDate: 10.07.2015
TP1 = TYCO_RCT-0C: Test Point; Part Description: 0805 (2012) Surface Mount Test Point; Manufacturer: TYCO ELECTRONICS; Manufacturer Part Number: RCT-0C; PressFit: No; Part Number: TYCO_RCT-0C; Component Kind: Standard; Component Type: Standard; Pin Count: 1; Mounted: Yes; Socket: No; SMD: Yes; Sense: No; Status: None; ComponentHeight: 1.45mm; HelpURL: \\cern.ch\dfs\Applications\Altium\Datasheets\TYCO_RCT-0C.pdf; Author: CERN DEM JLC; CreateDate: 07.05.2014; LatestRevisionDate: 07.05.2014
U1 U2 = CMP-0188-01008-2: 12-Bit Quad Digital-to-Analog Converter with EEPROM Memory, 10-pin MSOP, Extended Temperature; ComponentLink2URL: http://ww1.microchip.com/downloads/en/DeviceDoc/22187E.pdf; ComponentLink3Description: Package Specification; PackageReference: MSOP-UN10; ComponentLink3URL: http://www.microchip.com/stellent/groups/techpub_sg/documents/packagingspec/en012702.pdf; ComponentLink2Description: Datasheet; PackageDescription: 10-Lead Plastic Micro Small Outline Package (UN) [MSOP]; DatasheetVersion: revE, Oct-2010; RevisionNote: URLs added. DatasheetVersion updated.; PackageVersion: revBB, Aug-2009; ComponentLink1Description: Manufacturer URL; ComponentLink1URL: http://www.microchip.com/
U3 = CMP-04896-000053-1: IC QUAD LV COMPARATOR 14-SOIC; Operating Supply Voltage: 5V; Supply Current: 300uA; Output Compatibility: CMOS; Voltage Gain: 93.98dB; Output Current per Channel: 10mA; Response Time: 600ns; Quiescent Current: 350uA; Min Supply Voltage: 2.7V; Max Input Current: 250nA; Number of Elements: 4; Max Supply Voltage: 5.5V; Max Supply Current: 75uA; Input Offset Voltage (Vos): 7mV; Output Current: 84mA; RoHS Compliant: Yes; Number of Pins: 14; Min Operating Temperature: -40°C; Case/Package: SOIC; Series: LMV339; Mount: Surface Mount; Technology: BIPOLAR; REACH SVHC: No SVHC; Max Operating Temperature: 125°C; Package Quantity: 1; Packaging: Tape and Reel; Contact Plating: Gold; Nominal Supply Current: 300uA; Lead Free: Lead Free; Width: 3.91mm; Input Bias Current: 250nA; Weight: 0.004564oz; Height: 1.58mm; Length: 8.65mm; Propagation Delay: 600ns; Number of Channels: 4; Radiation Hardening: No; Type: General Purpose